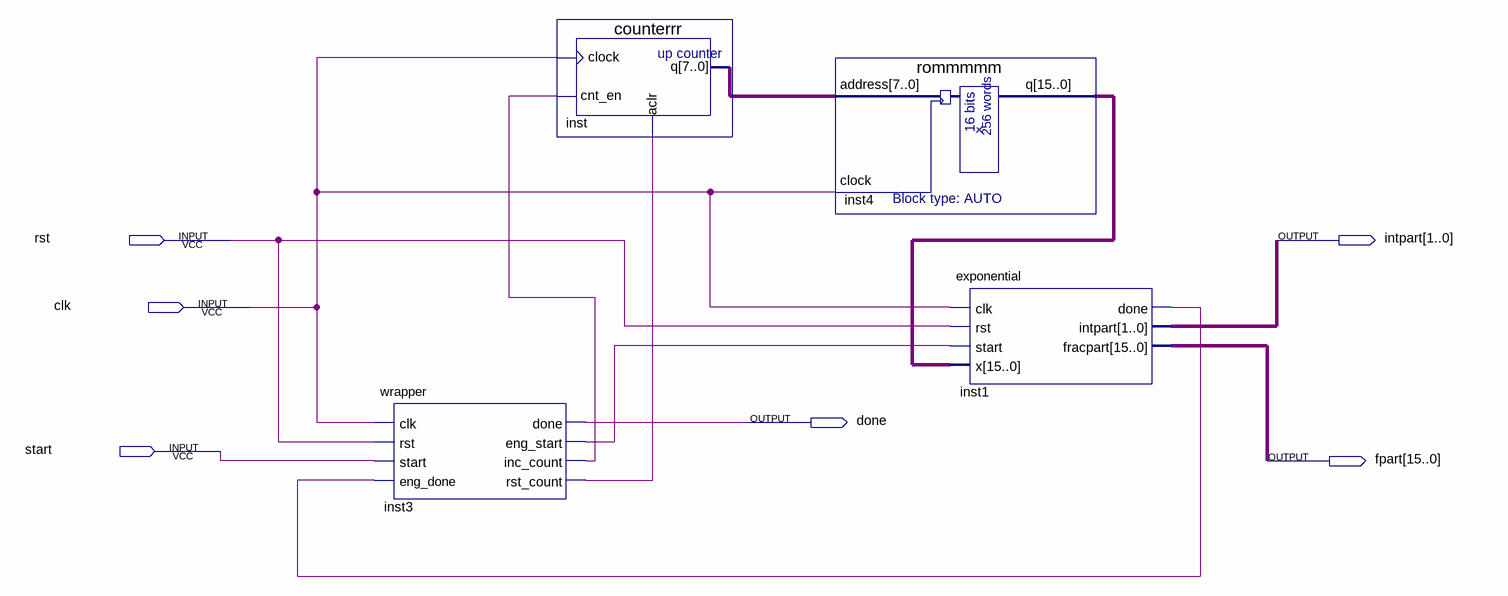
[diagram p0: schematic sheet]
// Quartus schematic wrapperrr.bdf as structural Verilog: 4 symbols, 6 pins
module wrapperrr (
  input  rst,
  input  clk,
  input  start,
  output [1:0] intpart,
  output done,
  output [15:0] fpart
);

  wire inst1_done, inst3_eng_start, inst3_inc_count, inst3_rst_count;
  wire [7:0] inst_q;
  wire [15:0] inst4_q;

  wrapper inst3 (
    .clk(clk), .rst(rst), .start(start), .eng_done(inst1_done), .done(done), .eng_start(inst3_eng_start),
    .inc_count(inst3_inc_count), .rst_count(inst3_rst_count));
  counterrr inst (.clock(clk), .cnt_en(inst3_inc_count), .aclr(inst3_rst_count), .q(inst_q));
  rommmmm inst4 (.address(inst_q), .clock(clk), .q(inst4_q));
  exponential inst1 (
    .clk(clk), .rst(rst), .start(inst3_eng_start), .x(inst4_q), .done(inst1_done), .intpart(intpart),
    .fracpart(fpart));
endmodule
